# Altium schematic sheet 0_ADSTM32_Overview.SchDoc
size A4; SheetNumber: 1; SheetTotal: 4
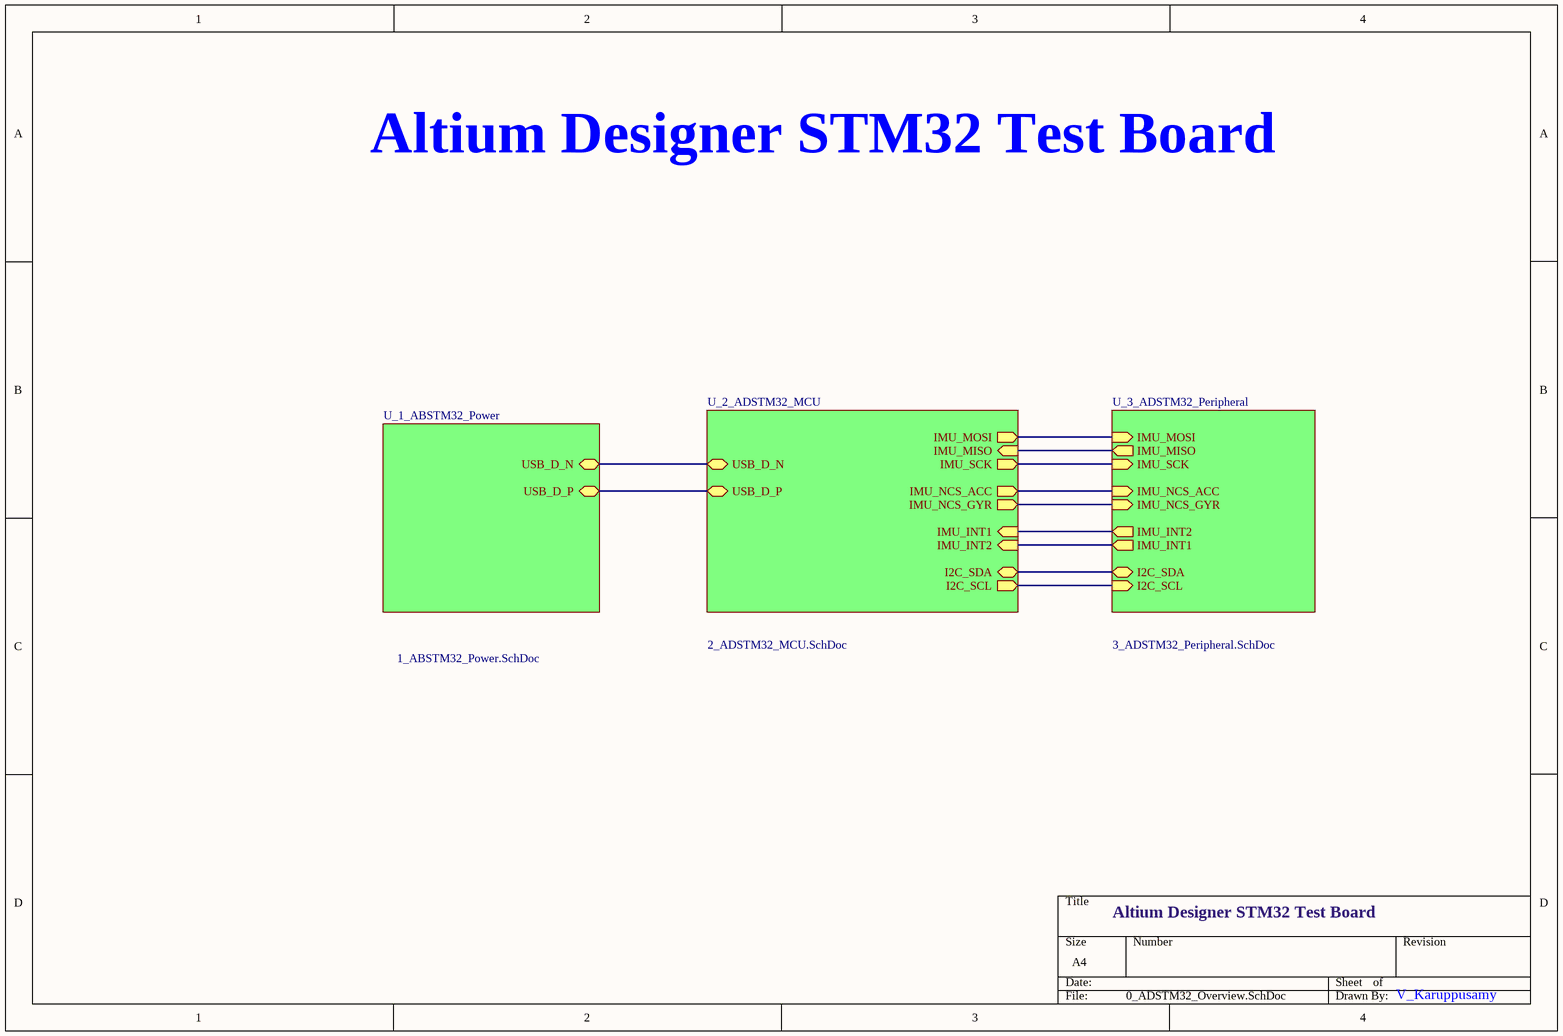
[diagram p0: 0_ADSTM32_Overview.SchDoc]

## Sub-sheets
U_1_ABSTM32_Power = 1_ABSTM32_Power.SchDoc: USB_D_N (bidir), USB_D_P (bidir)
U_2_ADSTM32_MCU = 2_ADSTM32_MCU.SchDoc: USB_D_N (bidir), USB_D_P (bidir), IMU_SCK (out), IMU_NCS_ACC (out), IMU_NCS_GYR (out), IMU_MOSI (out), IMU_MISO (in), I2C_SCL (out), I2C_SDA (bidir), IMU_INT1 (in), IMU_INT2 (in)
U_3_ADSTM32_Peripheral = 3_ADSTM32_Peripheral.SchDoc: IMU_SCK (in), IMU_MOSI (in), IMU_NCS_ACC (in), IMU_NCS_GYR (in), IMU_MISO (out), IMU_INT1 (out), IMU_INT2 (out), I2C_SCL (in), I2C_SDA (bidir)

## Nets
(unnamed): sheet U_1_ABSTM32_Power/USB_D_N, sheet U_2_ADSTM32_MCU/USB_D_N
(unnamed): sheet U_1_ABSTM32_Power/USB_D_P, sheet U_2_ADSTM32_MCU/USB_D_P
(unnamed): sheet U_3_ADSTM32_Peripheral/IMU_SCK, sheet U_2_ADSTM32_MCU/IMU_SCK
(unnamed): sheet U_3_ADSTM32_Peripheral/IMU_MOSI, sheet U_2_ADSTM32_MCU/IMU_MOSI
(unnamed): sheet U_3_ADSTM32_Peripheral/IMU_NCS_ACC, sheet U_2_ADSTM32_MCU/IMU_NCS_ACC
(unnamed): sheet U_3_ADSTM32_Peripheral/IMU_NCS_GYR, sheet U_2_ADSTM32_MCU/IMU_NCS_GYR
(unnamed): sheet U_3_ADSTM32_Peripheral/IMU_MISO, sheet U_2_ADSTM32_MCU/IMU_MISO
(unnamed): sheet U_3_ADSTM32_Peripheral/IMU_INT1, sheet U_2_ADSTM32_MCU/IMU_INT2
(unnamed): sheet U_3_ADSTM32_Peripheral/IMU_INT2, sheet U_2_ADSTM32_MCU/IMU_INT1
(unnamed): sheet U_3_ADSTM32_Peripheral/I2C_SCL, sheet U_2_ADSTM32_MCU/I2C_SCL
(unnamed): sheet U_3_ADSTM32_Peripheral/I2C_SDA, sheet U_2_ADSTM32_MCU/I2C_SDA

## Notes on the sheet
- Altium Designer STM32 Test Board
- V_Karuppusamy